# EasyEDA Pro project CandyCaneS2.eprj

# Schematic Schematic1

## Sheets
1 P1: Board Name: Board1; Create Date: 2024-09-03
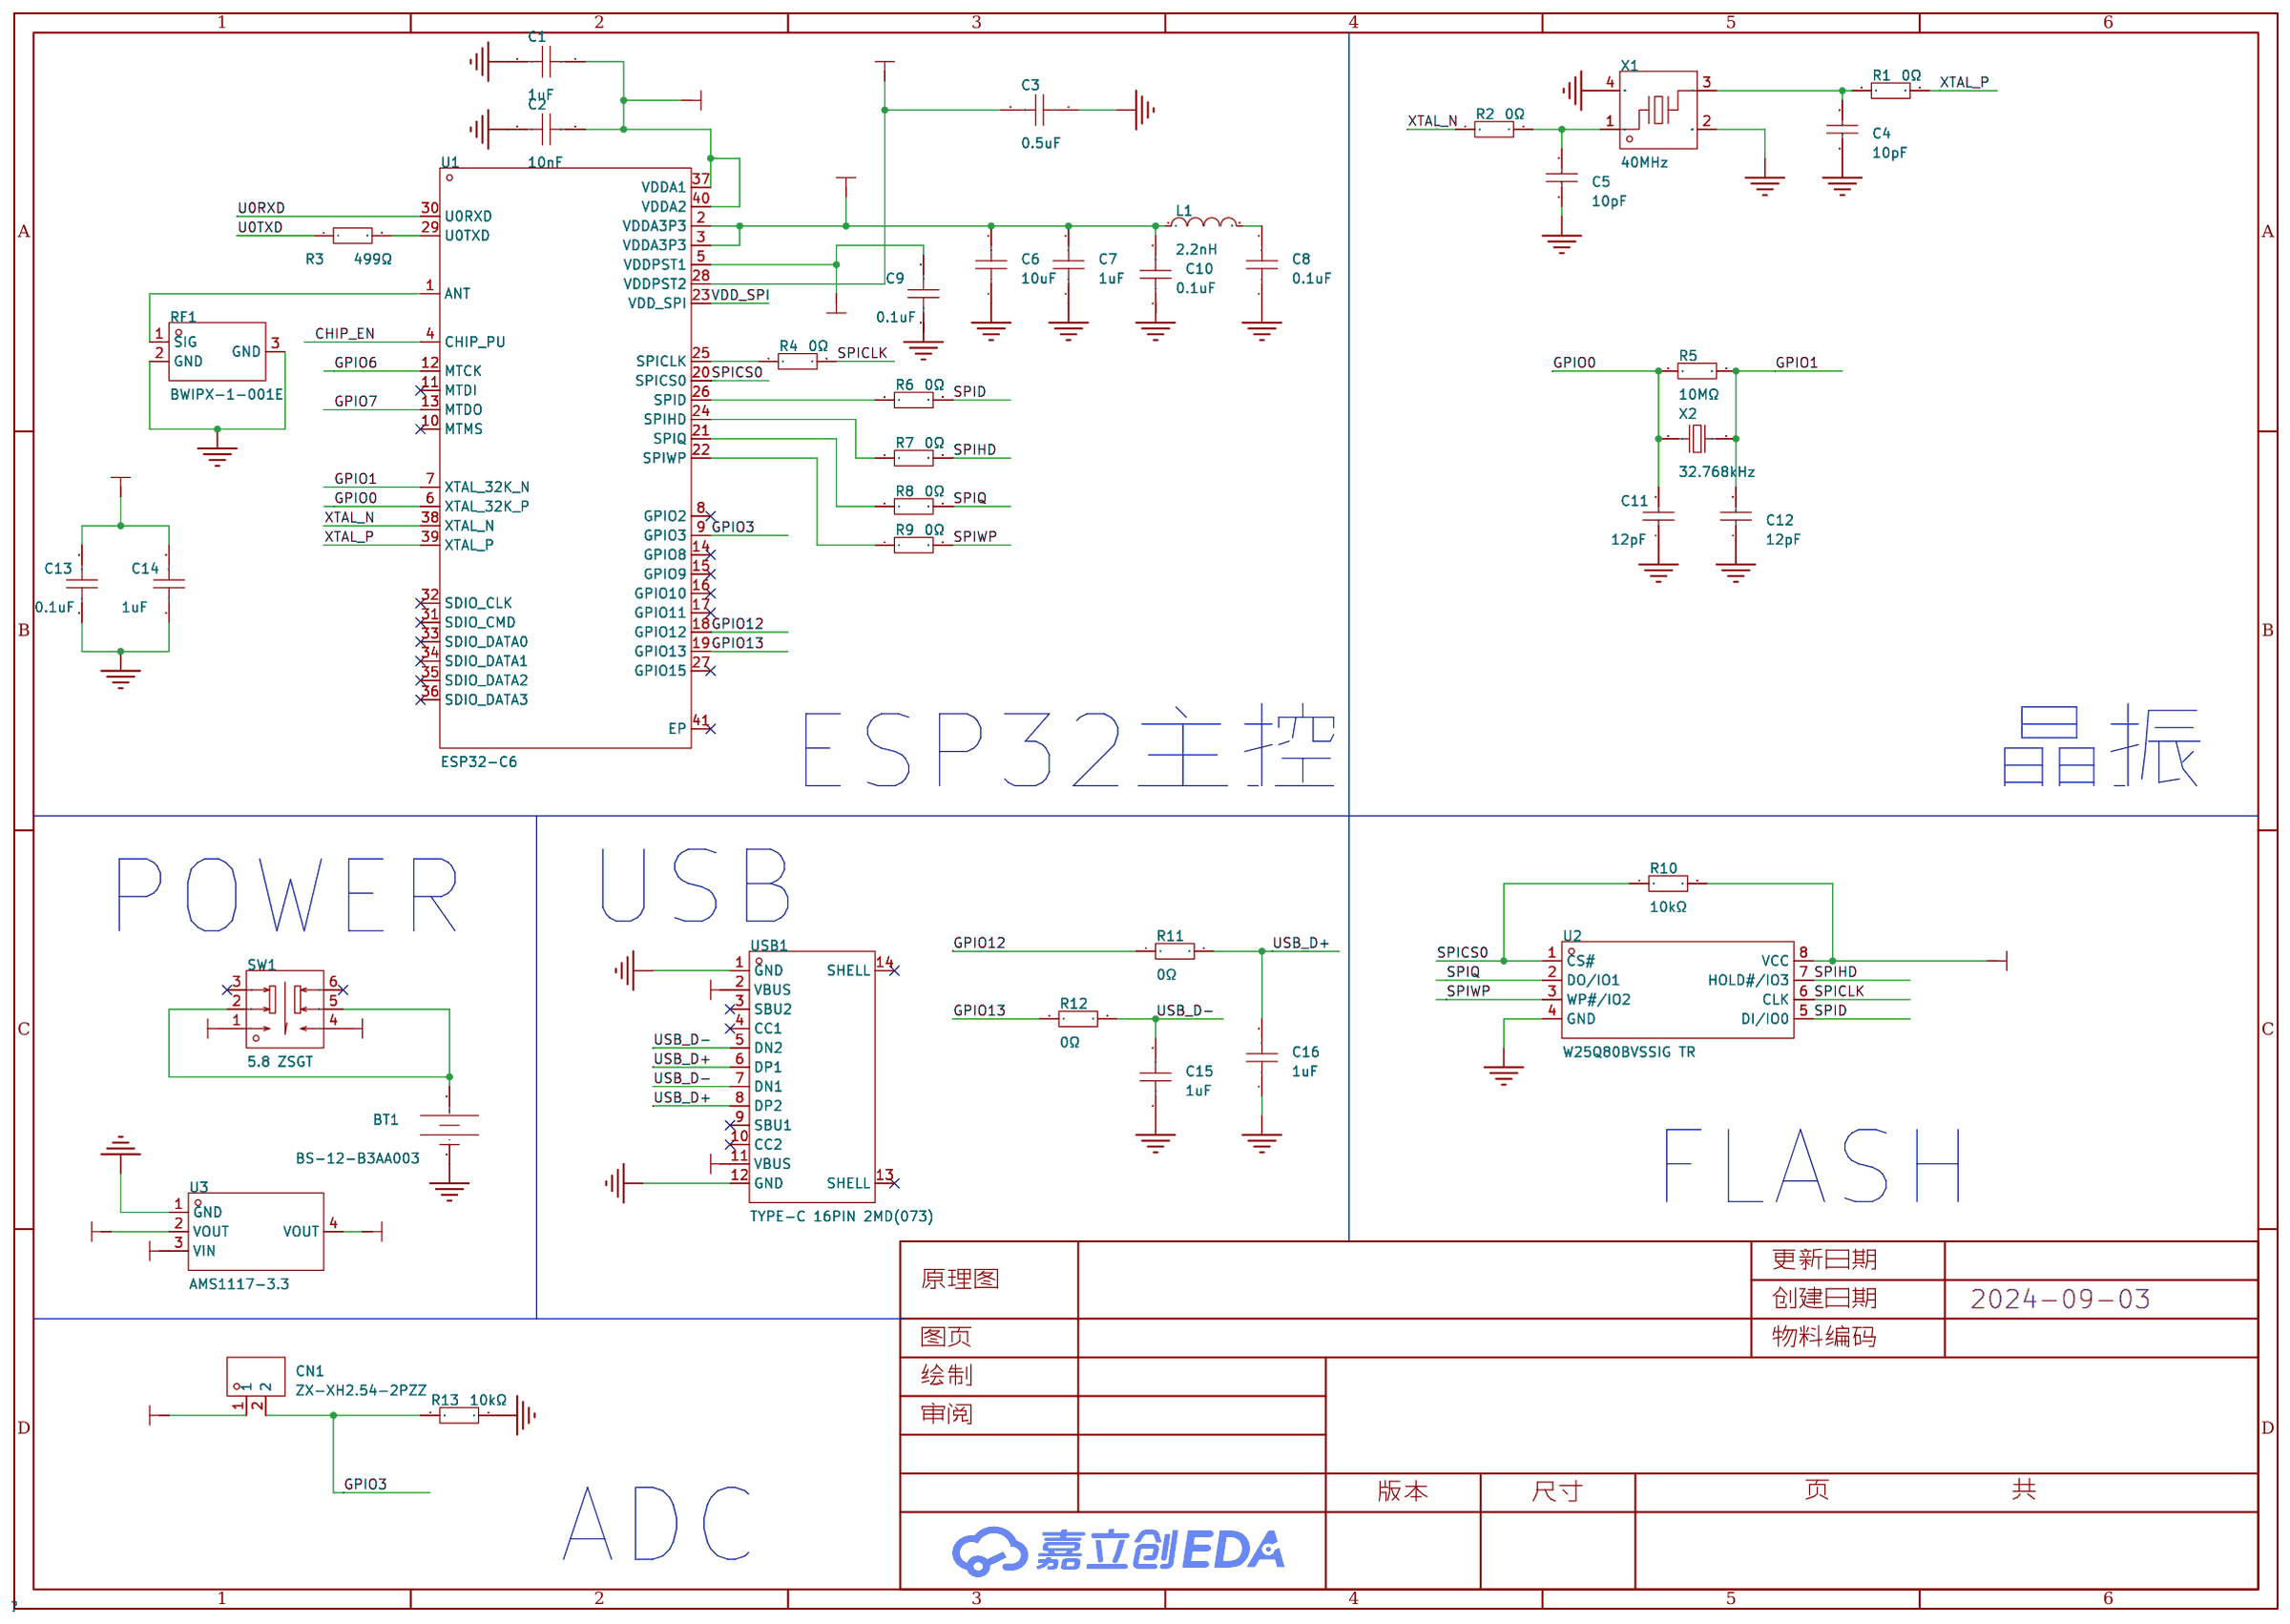
[diagram p0: P1]
2 P2
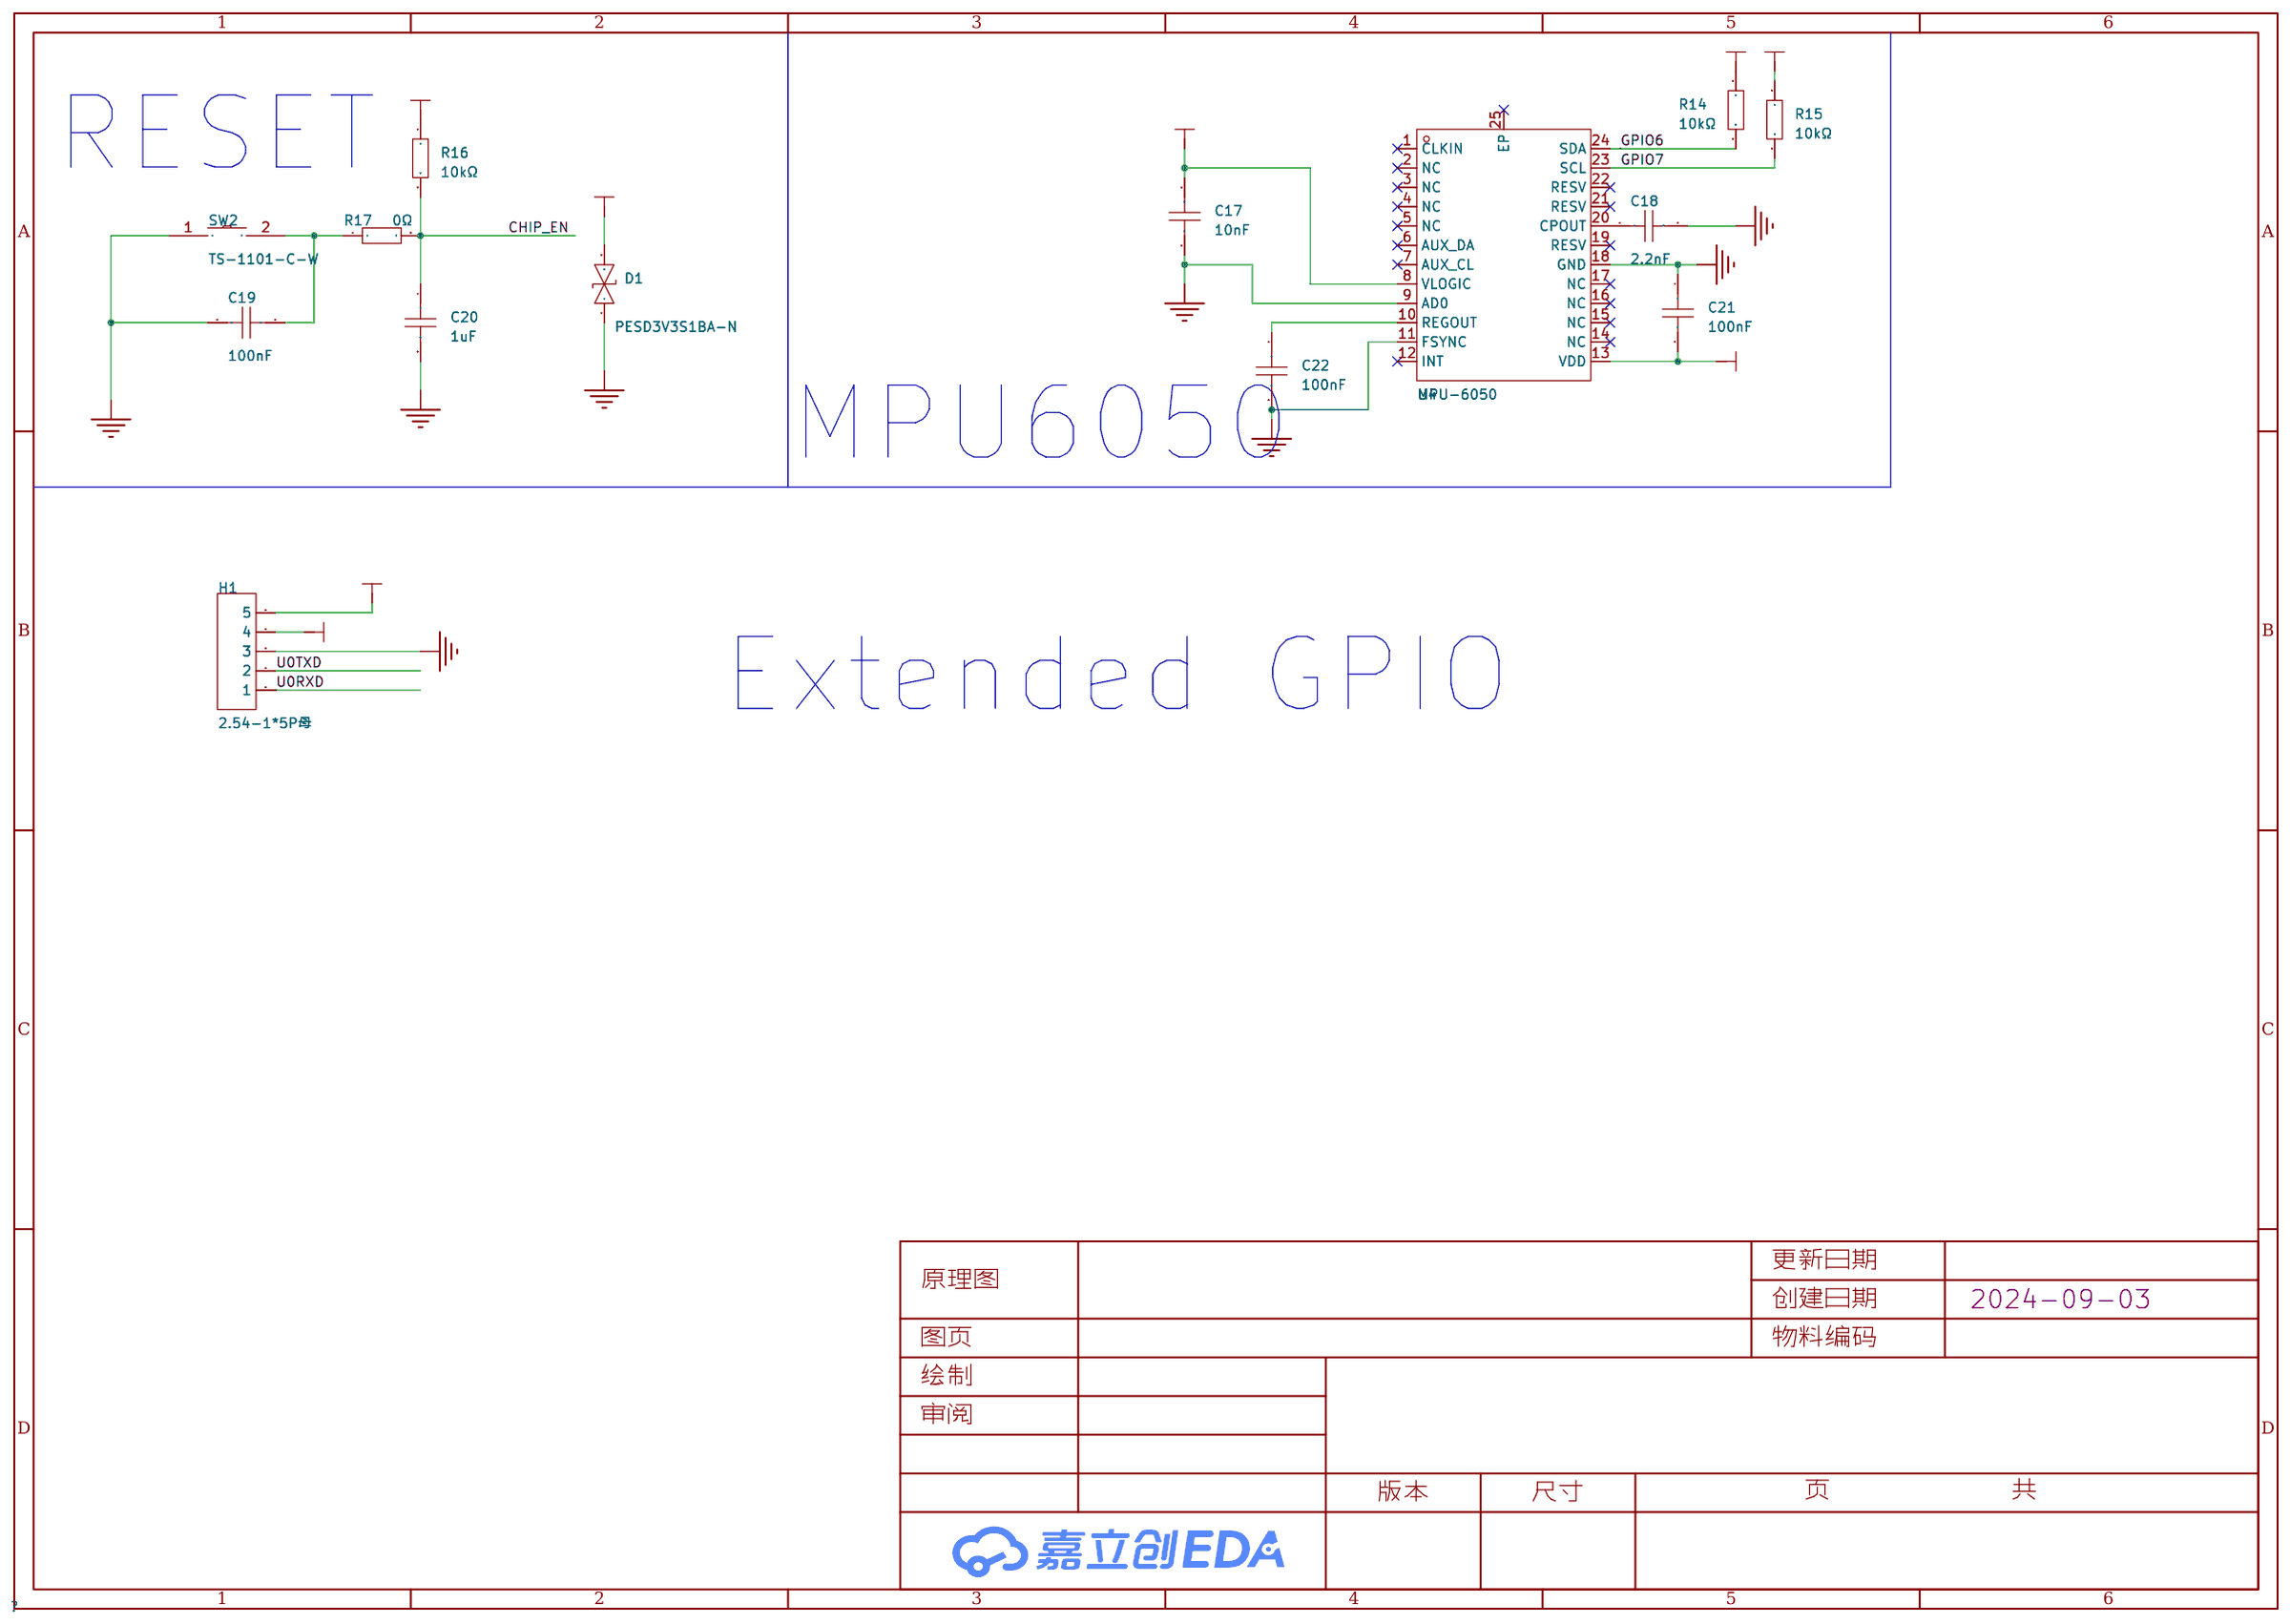
[diagram p1: P2]

## Parts
sheet P1
BT1  BS-12-B3AA003  [BAT-SMD_BS-12-B3AA011]
C1  1uF  [C0603]
C2  10nF  [C0603]
C3  0.5uF  [C0603]
C4  10pF  [C0603]
C5  10pF  [C0603]
C6  10uF  [C0603]
C7  1uF  [C0603]
C8  0.1uF  [C0603]
C9  0.1uF  [C0603]
C10  0.1uF  [C0603]
C11  12pF  [C0603]
C12  12pF  [C0603]
C13  0.1uF  [C0603]
C14  1uF  [C0603]
C15  1uF  [C0603]
C16  1uF  [C0603]
CN1  ZX-XH2.54-2PZZ  [CONN-TH_2P-P2.50_HX25003-2A]
L1  2.2nH  [L0603]
R1  0Ω  [R0603]
R2  0Ω  [R0603]
R3  499Ω  [R0603]
R4  0Ω  [R0603]
R5  10MΩ  [R0603]
R6  0Ω  [R0603]
R7  0Ω  [R0603]
R8  0Ω  [R0603]
R9  0Ω  [R0603]
R10  10kΩ  [R0603]
R11  0Ω  [R0603]
R12  0Ω  [R0603]
R13  10kΩ  [R0603]
RF1  BWIPX-1-001E  [IPEX-SMD_BWIPX-1-001E]
SW1  5.8 ZSGT  [SW-TH_5.8ZSGT]
U1  ESP32-C6  [QFN-40_L5.0-W5.0-P0.40-TL-EP3.3]
U2  W25Q80BVSSIG TR  [SOIC-8_L5.3-W5.3-P1.27-LS7.9-BL]
U3  AMS1117-3.3  [SOT-223-3_L6.5-W3.4-P2.30-LS7.0-BR]
USB1  TYPE-C 16PIN 2MD(073)  [USB-C-SMD_TYPE-C-6PIN-2MD-073]
X1  40MHz  [CRYSTAL-SMD_4P-L3.2-W2.5-BL]
X2  32.768kHz  [FC-135R_L3.2-W1.5]
sheet P2
C17  10nF  [C0603]
C18  2.2nF  [C0603]
C19  100nF  [C0603]
C20  1uF  [C0603]
C21  100nF  [C0603]
C22  100nF  [C0603]
D1  PESD3V3S1BA-N  [SOD-523_L1.2-W0.8-LS1.6-BI]
H1  2.54-1*5P母  [HDR-TH_5P-P2.54-V-F]
R14  10kΩ  [R0603]
R15  10kΩ  [R0603]
R16  10kΩ  [R0603]
R17  0Ω  [R0603]
SW2  TS-1101-C-W  [SW-SMD_L6.0-W3.3-LS8.0]
U4  MPU-6050  [QFN-24_L4.0-W4.0-P0.50-BL-EP2.7]

## Library data of the parts
BT1 = BS-12-B3AA003: 连接器类型:电池底座;适用电池规格:CR1220;触头材质:磷青铜;工作温度范围:-25℃~+85℃;; LCSC Part Name: 电池底座 适用电池:CR1220; Supplier Part: C964723; Manufacturer: MYOUNG(美阳); Supplier Footprint: SMD; JLCPCB Part Class: 扩展库; Datasheet: https://atta.szlcsc.com/upload/public/pdf/source/20201218/C964723_733B638E287393F86295A2A4DAE43C75.pdf; Supplier: LCSC; Connector Type: 电池底座; Battery Type: CR1220; Contact Material: 磷青铜; Operating Temperature Range: -25℃~+85℃
C1-C3 C6-C10 C13 C14 = CL10A106MA8NRNC: 容值:10uF;精度:±20%;额定电压:25V;材质(温度系数):X5R;; LCSC Part Name: 10uF ±20% 25V; Supplier Part: C96446; Manufacturer: SAMSUNG(三星); Supplier Footprint: 0603; JLCPCB Part Class: 基础库; Datasheet: https://atta.szlcsc.com/upload/public/pdf/source/20160218/1457707763339.pdf; Supplier: LCSC; Tolerance: ±20%; Voltage Rated: 25V; Temperature Coefficient: X5R
C4 C5 C11 C12 = CL10C100JB8NNNC: 容值:10pF;精度:±5%;额定电压:50V;材质(温度系数):C0G;; LCSC Part Name: 10pF ±5% 50V; Supplier Part: C1634; Manufacturer: SAMSUNG(三星); Supplier Footprint: 0603; JLCPCB Part Class: 基础库; Datasheet: https://atta.szlcsc.com/upload/public/pdf/source/20160218/1457707763339.pdf; Supplier: LCSC; Tolerance: ±5%; Voltage Rated: 50V; Temperature Coefficient: C0G
C15 C16 = CL10A105KB8NNNC: 容值:1uF;精度:±10%;额定电压:50V;材质(温度系数):X5R;; LCSC Part Name: 1uF ±10% 50V; Supplier Part: C15849; Manufacturer: SAMSUNG(三星); Supplier Footprint: 0603; JLCPCB Part Class: 基础库; Datasheet: https://atta.szlcsc.com/upload/public/pdf/source/20160218/1457707763339.pdf; Supplier: LCSC; Tolerance: ±10%; Voltage Rated: 50V; Temperature Coefficient: X5R
CN1 = ZX-XH2.54-2PZZ: 插针结构:1x2P;间距:2.54mm;安装方式:直插;参考系列:XH;总PIN数:2P;排数:1;每排PIN数:2;行距:-;额定电流:3A;触头材质:黄铜;触头镀层:锡;工作温度范围:-25℃~+85℃;; Supplier Part: C7429632; Manufacturer: Megastar(兆星); Supplier Footprint: 插件,P=2.54mm; JLCPCB Part Class: 扩展库; Datasheet: https://atta.szlcsc.com/upload/public/pdf/source/20230619/19BA6947230AA44A04D3EDD65E618FD0.pdf; Supplier: LCSC; Pins Structure: 1x2P; Pitch: 2.54mm; Mounting Style: 直插; Reference Series: XH; Number of Pins: 2P; Number of Rows: 1; Number of PINs Per Row: 2; Current Rating (Max): 3A; Contact Material: 黄铜; Contact Plating: 锡; Operating Temperature Range: -25℃~+85℃
L1 = SCC1608C2N2SSP: 电感值:2.2nH;额定电流:500mA;饱和电流(Isat):-;直流电阻(DCR):200mΩ;; Supplier Part: C412026; Manufacturer: Sunltech(韩国顺磁); Supplier Footprint: 0603; JLCPCB Part Class: 扩展库; Datasheet: https://atta.szlcsc.com/upload/public/pdf/source/20190819/C412052_7E47CA9107AD18C13168C896A90007C8.pdf; Supplier: LCSC; Rated Current: 500mA; DC Resistance (DCR): 200mΩ
R1 R2 R4 R6-R17 = 0603WAF0000T5E: 电阻类型:厚膜电阻;阻值:0Ω;精度:±1%;功率:100mW;最大工作电压:75V;; LCSC Part Name: 0Ω ±1% 100mW 厚膜电阻; Supplier Part: C21189; Manufacturer: UNI-ROYAL(厚声); Supplier Footprint: 0603; JLCPCB Part Class: 基础库; Datasheet: https://atta.szlcsc.com/upload/public/pdf/source/20200306/C422600_1E6D84923E4A46A82E41ADD87F860B5C.pdf; Supplier: LCSC; Type: 厚膜电阻; Tolerance: ±1%; Power(Watts): 100mW; Overload Voltage (Max): 75V; Operating Temperature Range: -55℃~+155℃
R3 = 0603WAF4990T5E: 电阻类型:厚膜电阻;阻值:499Ω;精度:±1%;功率:100mW;最大工作电压:75V;温度系数:±100ppm/℃;; LCSC Part Name: 499Ω ±1% 100mW 厚膜电阻; Supplier Part: C23065; Manufacturer: UNI-ROYAL(厚声); Supplier Footprint: 0603; JLCPCB Part Class: 扩展库; Datasheet: https://atta.szlcsc.com/upload/public/pdf/source/20200306/C422600_1E6D84923E4A46A82E41ADD87F860B5C.pdf; Supplier: LCSC; Type: 厚膜电阻; Tolerance: ±1%; Power(Watts): 100mW; Overload Voltage (Max): 75V; Temperature Coefficient: ±100ppm/℃; Operating Temperature Range: -55℃~+155℃
R5 = 0603WAF1005T5E: 电阻类型:厚膜电阻;阻值:10MΩ;精度:±1%;功率:100mW;最大工作电压:75V;温度系数:±100ppm/℃;; LCSC Part Name: 10MΩ ±1% 100mW 厚膜电阻; Supplier Part: C7250; Manufacturer: UNI-ROYAL(厚声); Supplier Footprint: 0603; JLCPCB Part Class: 基础库; Datasheet: https://atta.szlcsc.com/upload/public/pdf/source/20200306/C422600_1E6D84923E4A46A82E41ADD87F860B5C.pdf; Supplier: LCSC; Type: 厚膜电阻; Tolerance: ±1%; Power(Watts): 100mW; Overload Voltage (Max): 75V; Temperature Coefficient: ±100ppm/℃; Operating Temperature Range: -55℃~+155℃
RF1 = BWIPX-1-001E: 连接器类型:板端;接口类型:内针;端口数量:1;接口直径:-;接口长度/高度:-;频率-最大值:6GHz;射频系列:IPEX;阻抗:50Ω;样式:-;工作温度范围:-;; LCSC Part Name: IPEX 内针; Supplier Part: C496552; Manufacturer: BAT WIRELESS(蝙蝠无线); Supplier Footprint: SMD; JLCPCB Part Class: 扩展库; Datasheet: https://atta.szlcsc.com/upload/public/pdf/source/20201223/C496552_05E5A9956EAE1A8819C5051D085B1DED.pdf; Supplier: LCSC; Connector Type: 板端; Interface Type: 内针; Number of Ports: 1; Frequency-Max: 6GHz; RF Series: IPEX; Impedance: 50Ω
SW1 = 5.8 ZSGT: 电路结构:双刀双掷;自锁/无锁:自锁;安装方式:直插;触点电流:110mA;额定电压 (DC):30V;带灯:不带;作用力:1.5N;机械寿命:10万次;; LCSC Part Name: 5.8*5.8有头/高头 带锁/自锁开关 泡泡机开关; Supplier Part: C2681587; Manufacturer: SHOU HAN(首韩); Supplier Footprint: 插件; JLCPCB Part Class: 扩展库; Datasheet: https://atta.szlcsc.com/upload/public/pdf/source/20210107/C2681587_CDDDDA4A1C7AC9FEB01815B75893A6BA.pdf; Supplier: LCSC; Circuit: 双刀双掷; Self Lock / No Lock: 自锁; Actuator Style: 方形按钮; Mounting Style: 直插; Contact Current: 110mA; Voltage Rating (DC): 30V; Insulation Resistance: 100MΩ; Actuator/Cap Color: 白色; With Lamp: 不带; Pin Style: PC引脚; Operating Force: 1.5N; Operating Temperature: -10℃~+70℃; Mechanical Life: 10万次
U1 = ESP32-C6_1: Supplier Part: C5364646; Manufacturer: ESPRESSIF(乐鑫); Supplier Footprint: QFN-40-EP(5x5); JLCPCB Part Class: 扩展库; Datasheet: https://atta.szlcsc.com/upload/public/pdf/source/20240709/55E0756C6C858111D660688444CD08EE.pdf; Supplier: LCSC
U2 = W25Q80BVSSIG TR: Supplier Part: C19315515; Manufacturer: WINBOND(华邦); Supplier Footprint: SOIC-8; JLCPCB Part Class: 扩展库; Datasheet: https://atta.szlcsc.com/upload/public/pdf/source/20231219/79C5C7080006D2B8D7319E62F0D0E051.pdf; Supplier: LCSC
U3 = AMS1117-3.3_C6186: 输出类型:固定;最大输入电压:-;输出电压:3.3V;最大输出电流:1A;电源纹波抑制比(PSRR):72dB@(120Hz);输出极性:正极;; LCSC Part Name: 输出3.3V 1A; Supplier Part: C6186; Manufacturer: AMS; Supplier Footprint: SOT-223; JLCPCB Part Class: 基础库; Datasheet: https://atta.szlcsc.com/upload/public/pdf/source/20180727/C6186_7A095716F0823C02F1997A905E26C086.pdf; Supplier: LCSC; Output Type: 固定; Output Voltage: 3.3V; MAX Output Current: 1A; Power Supply Rejection Ratio (PSRR): 72dB@(120Hz); Dropout Voltage: 1.3V@(800mA); Output Polarity: 正极; Number of Outputs: 1
USB1 = TYPE-C 16PIN 2MD(073): 连接器类型:Type-C;标准:-;公母:母;端口数量:1;触点数量:16P;安装方式:卧贴;额定电流 - 电源:5A;工作温度范围:-25℃~+85℃;; LCSC Part Name: Type-C 母 卧贴; Supplier Part: C2765186; Manufacturer: SHOU HAN(首韩); Supplier Footprint: SMD; JLCPCB Part Class: 扩展库; Datasheet: https://atta.szlcsc.com/upload/public/pdf/source/20211123/39B17C16241EAC15C5E277BDA434118E.pdf; Supplier: LCSC; Connector Type: Type-C; Gender: 母; Number of Ports: 1; Number of Contacts: 16P; Mounting Style: 卧贴; Current Rating - Power (Max): 5A; Operating Temperature Range: -25℃~+85℃
X1 = XL2EL89COI-111YLC-40M: 晶振类型:贴片晶振;频率:40MHz;常温频差:±10ppm;外接负载电容:12pF;频率稳定度(全温):±20ppm;; LCSC Part Name: 40MHz ±10ppm 12pF; Supplier Part: C18214314; Manufacturer: YXC(扬兴晶振); Supplier Footprint: SMD3225-4P; JLCPCB Part Class: 扩展库; Datasheet: https://atta.szlcsc.com/upload/public/pdf/source/20240329/19D5F850207469550BEB00D7DFEDBC7A.pdf; Supplier: LCSC; Crystal Type: 贴片晶振; Normal temperature Frequency Tolerance: ±10ppm; External load capacitor: 12pF; Frequency Stability(Full temperature range): ±20ppm; Operating Temperature: -40℃~+85℃
X2 = Q13FC13500004_C32346: 晶振类型:贴片晶振;频率:32.768kHz;常温频差:±20ppm;外接负载电容:12.5pF;; LCSC Part Name: 32.768kHz ±20ppm 12.5pF; Supplier Part: C32346; Manufacturer: EPSON(爱普生); Manufacturer Part: Q13FC13500004; Supplier Footprint: SMD3215-2P; JLCPCB Part Class: 基础库; Datasheet: https://atta.szlcsc.com/upload/public/pdf/source/20240418/0E0FF5F0356BA3753F616001439D1416.pdf; Supplier: LCSC; Crystal Type: 贴片晶振; Normal temperature Frequency Tolerance: ±20ppm; External load capacitor: 12.5pF; Equivalent Series Resistance (ESR): 70kΩ; Operating Temperature: -40℃~+85℃
C17-C22 = CL10B104KB8NNNC: 容值:100nF;精度:±10%;额定电压:50V;材质(温度系数):X7R;; LCSC Part Name: 100nF ±10% 50V; Supplier Part: C1591; Manufacturer: SAMSUNG(三星); Supplier Footprint: 0603; JLCPCB Part Class: 扩展库; Datasheet: https://atta.szlcsc.com/upload/public/pdf/source/20160218/1457707763339.pdf; Supplier: LCSC; Tolerance: ±10%; Voltage Rated: 50V; Temperature Coefficient: X7R
D1 = PESD3V3S1BA-N_C316037: 反向截止电压(Vrwm):3.3V@Max;最大钳位电压:10V;峰值脉冲电流(Ipp)@10/1000us:10A@8/20us;击穿电压:4V;; Supplier Part: C316037; Manufacturer: BORN(伯恩半导体); Supplier Footprint: SOD-523; JLCPCB Part Class: 扩展库; Datasheet: https://atta.szlcsc.com/upload/public/pdf/source/20181025/C316037_BAF19C01D27FCD10CB9CD774B67153C5.pdf; Supplier: LCSC; Reverse Stand-Off Voltage (Vrwm): 3.3V@Max; Maximum Clamping Voltage: 10V; Peak Pulse Current (Ipp)@10/1000us: 10A@8/20us; Breakdown Voltage: 4V; Type: TVS
H1 = 2.54-1*5P母: 插孔结构:1x5P;间距:2.54mm;行距:-;安装类型:直插;排数:单排;总孔位数:5P;塑高:-;触头材质:-;触头镀层:-;; LCSC Part Name: 间距:2.54mm 1x5P 直插; Supplier Part: C50950; Manufacturer: BOOMELE(博穆精密); Supplier Footprint: 插件,P=2.54mm; JLCPCB Part Class: 扩展库; Datasheet: https://atta.szlcsc.com/upload/public/pdf/source/20210301/C2718488_F4427B881E42CAA8DDB0B1C12B3A522C.pdf; Supplier: LCSC; Holes Structure: 1x5P; Pitch: 2.54mm; Mounting Type: 直插; Number of Rows: 单排; Number of Holes: 5P
SW2 = TS-1101-C-W: 电路结构:单刀单掷;按钮形状:矩形按钮;作用力:260gf;安装方式:立贴;开关长度:6mm;开关宽度:3.6mm;开关高度:2.5mm;带支架:不带;触点电流:50mA;额定电压(AC):-;额定电压(DC):12V;额定功率:-;绝缘电阻:-;带灯:无;机械寿命:5万次;; LCSC Part Name: 6*3.6*2.5mm 立贴 轻触开关; Supplier Part: C318938; Manufacturer: XKB Connectivity(中国星坤); Supplier Footprint: SMD; JLCPCB Part Class: 扩展库; Datasheet: https://atta.szlcsc.com/upload/public/pdf/source/20200227/C318938_C2E53B1EEDE37D980A33616AC086DE53.pdf; Supplier: LCSC; Circuit: 单刀单掷; Actuator Style: 矩形按钮; Operating Force: 260gf; Mounting Style: 立贴; Switch Length: 6mm; Switch Width: 3.6mm; Switch Height: 2.5mm; Strike Gundam: 不带; Contact Current: 50mA; Voltage Rating (DC): 12V; Actuator/Cap Color: 白色带淡绿; With Lamp: 无; Mechanical Life: 5万次; Operating Temperature: -30℃~+85℃
U4 = MPU-6050: 传感器类型:加速度计陀螺仪;; Supplier Part: C24112; Manufacturer: TDK InvenSense(应美盛); Supplier Footprint: QFN-24-EP(4x4); JLCPCB Part Class: 扩展库; Datasheet: https://atta.szlcsc.com/upload/public/pdf/source/20140425/1457707046159.pdf; Supplier: LCSC; Sensor Type: 加速度计陀螺仪; Operating Temperature: -40℃~+85℃

## Nets
GND: BT1.2(-) C1.2 C2.1 C3.1 C4.1 C5.1 C6.1 C7.1 C8.1 C9.1 C10.1 C11.1 C12.1 C13.1 C14.1 C15.1 C16.1 C17.2 C18.2 C19.2 C20.2 C21.1 C22.2 D1.1 H1.3 R13.2 RF1.2(GND) RF1.3(GND) SW2.1 U2.4(GND) U3.1(GND) U4.9(AD0) U4.11(FSYNC) U4.18(GND) USB1.1(GND) USB1.12(GND) X1.2(GND) X1.4(GND)
VBAT: H1.5 SW1.1 SW1.4 U3.3(VIN) USB1.2(VBUS) USB1.11(VBUS)
VDD33: C1.1 C2.2 C3.2 C6.2 C7.2 C9.2 C10.2 C17.1 C21.2 CN1.1 D1.2 H1.4 L1.1 R14.1 R15.1 R16.1 U1.2(VDDA3P3) U1.3(VDDA3P3) U1.5(VDDPST1) U1.28(VDDPST2) U1.37(VDDA1) U1.40(VDDA2) U3.2(VOUT) U3.4(VOUT) U4.8(VLOGIC) U4.13(VDD)
VDD_SPI: C13.2 C14.2 R10.2 U1.23(VDD_SPI) U2.8(VCC)
CHIP_EN: C20.1 R16.2 R17.2 U1.4(CHIP_PU)
GPIO0: C11.2 R5.1 U1.6(XTAL_32K_P) X2.1
GPIO1: C12.2 R5.2 U1.7(XTAL_32K_N) X2.2
GPIO3: CN1.2 R13.1 U1.9(GPIO3)
GPIO6: R14.2 U1.12(MTCK) U4.24(SDA)
GPIO7: R15.2 U1.13(MTDO) U4.23(SCL)
GPIO12: R11.1 U1.18(GPIO12)
GPIO13: R12.1 U1.19(GPIO13)
SPICLK: R4.2 U2.6(CLK)
SPICS0: R10.1 U1.20(SPICS0) U2.1(CS#)
SPID: R6.2 U2.5(DI/IO0)
SPIHD: R7.2 U2.7(HOLD#/IO3)
SPIQ: R8.2 U2.2(DO/IO1)
SPIWP: R9.2 U2.3(WP#/IO2)
U0RXD: H1.1 U1.30(U0RXD)
U0TXD: H1.2 R3.1
USB_D+: C16.2 R11.2 USB1.6(DP1) USB1.8(DP2)
USB_D-: C15.2 R12.2 USB1.5(DN2) USB1.7(DN1)
XTAL_N: R2.1 U1.38(XTAL_N)
XTAL_P: R1.2 U1.39(XTAL_P)
$1N461: RF1.1(SIG) U1.1(ANT)
$1N695: C8.2 L1.2
$1N1096: R4.1 U1.25(SPICLK)
$1N1204: R8.1 U1.21(SPIQ)
$1N1242: R9.1 U1.22(SPIWP)
$1N1499: R7.1 U1.24(SPIHD)
$1N1548: R6.1 U1.26(SPID)
$1N1698: R3.2 U1.29(U0TXD)
$1N2295: C4.2 R1.1 X1.3
$1N2413: C5.2 R2.2 X1.1
$1N3029: BT1.1(+) SW1.2 SW1.5
$2N245: C19.1 R17.1 SW2.2
$2N875: C18.1 U4.20(CPOUT)
$2N1093: C22.1 U4.10(REGOUT)

Not connected (* = marked no-connect by the designer): SW1 3* 6*; U1 8(GPIO2)* 10(MTMS)* 11(MTDI)* 14(GPIO8)* 15(GPIO9)* 16(GPIO10)* 17(GPIO11)* 27(GPIO15)* 31(SDIO_CMD)* 32(SDIO_CLK)* 33(SDIO_DATA0)* 34(SDIO_DATA1)* 35(SDIO_DATA2)* 36(SDIO_DATA3)* 41(EP)*; U4 1(CLKIN)* 2(NC)* 3(NC)* 4(NC)* 5(NC)* 6(AUX_DA)* 7(AUX_CL)* 12(INT)* 14(NC)* 15(NC)* 16(NC)* 17(NC)* 19(RESV)* 21(RESV)* 22(RESV)* 25(EP)*; USB1 3(SBU2)* 4(CC1)* 9(SBU1)* 10(CC2)* 13(SHELL)* 14(SHELL)*

## Notes on the sheets
sheet 1
- ESP32主控
- 晶振
- USB
- POWER
- FLASH
- ADC
sheet 2
- RESET
- MPU6050
- Extended GPIO

# Board PCB1
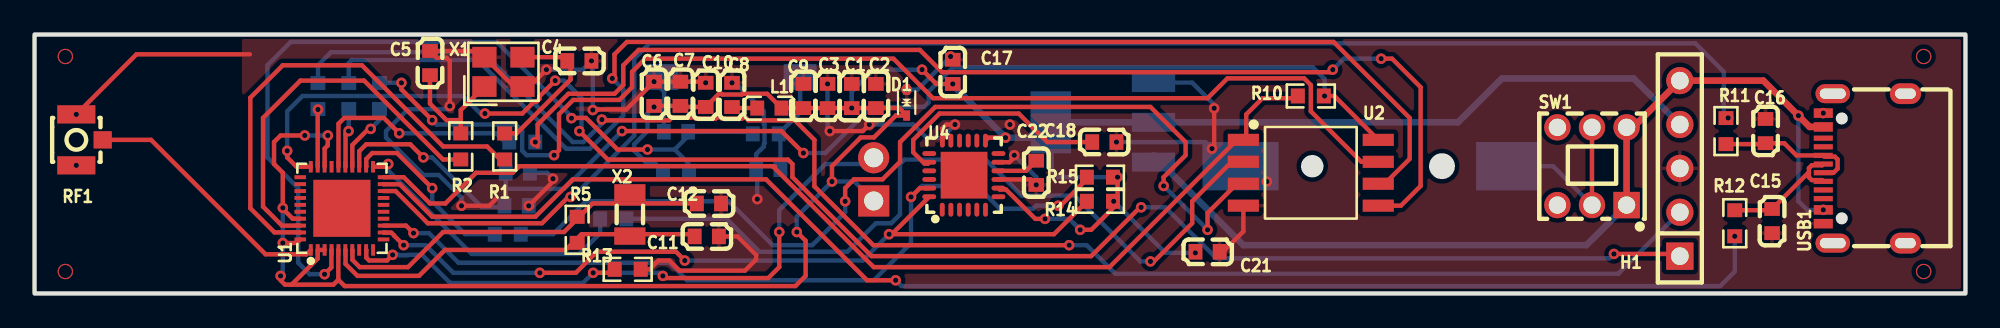
[diagram p2: board, top side]
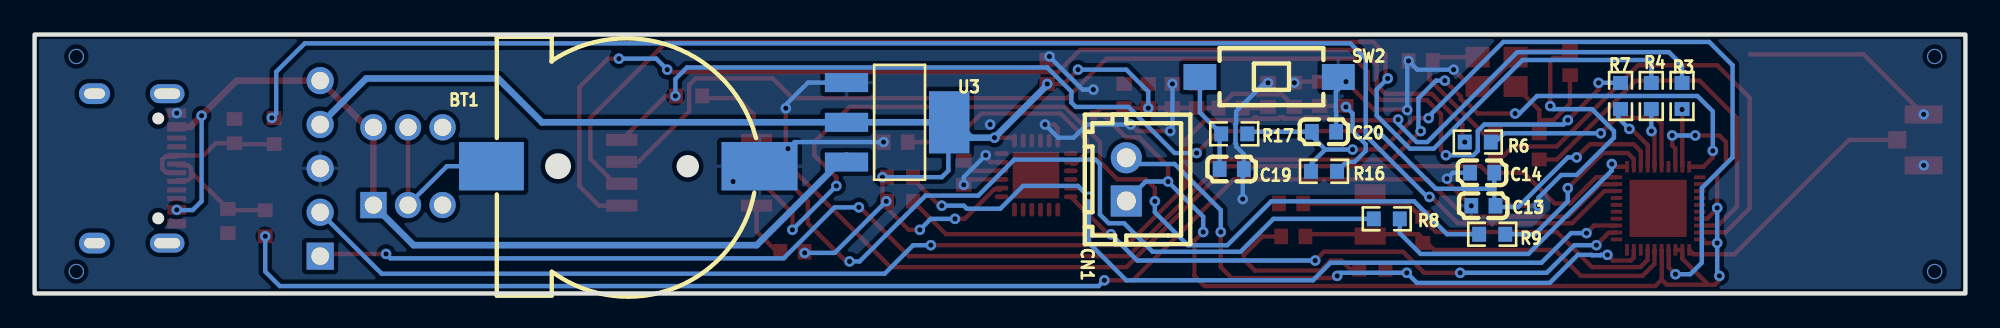
[diagram p3: board, bottom side, seen from below]

Outline 111.63 x 14.99 mm; copper layers: Top Layer, Bottom Layer. Coordinates in mm from the lower left corner of the outline.
Outline path: rectangle 0,14.99 111.63,0
Stack: Top Layer 0.035mm / Dielectric1 1.51mm FR4 er 4.5 / Bottom Layer 0.035mm

## Design rules (mm)
template: JLCPCB Capability(Two Layers Board)
spacing copperThickness1oz (default): track to track 0.102, other pairs 0.152 to 0.3
spacing copperThickness2oz: track to track 0.203, other pairs 0.152 to 0.3
track width copperThickness1oz (default): min 0.127, default 0.254, max 2.54
track width copperThickness2oz: min 0.203, default 0.254, max 2.54
differential pair differentialPair (default): width min 0.127, default 0.254, max 2.54; gap min 0.152, default 0.152
via viaSize (default): diameter min 0.5, default 0.61, max 10; hole min 0.3, default 0.305, max 6.3

## Placement (name value [footprint] x y rotation side)
BT1  BS-12-B3AA003  [BAT-SMD_BS-12-B3AA011]  77.47 7.37 0 bottom
C1  1uF  [C0603]  47.24 11.43 90 top
C2  10nF  [C0603]  48.64 11.43 270 top
C3  0.5uF  [C0603]  45.85 11.43 270 top
C4  10pF  [C0603]  31.5 13.46 180 top
C5  10pF  [C0603]  22.86 13.34 270 top
C6  10uF  [C0603]  35.81 11.56 270 top
C7  1uF  [C0603]  37.34 11.56 270 top
C8  0.1uF  [C0603]  40.32 11.49 270 top
C9  0.1uF  [C0603]  44.45 11.43 270 top
C10  0.1uF  [C0603]  38.8 11.5 270 top
C11  12pF  [C0603]  38.86 3.3 180 top
C12  12pF  [C0603]  38.99 5.21 180 top
C13  0.1uF  [C0603]  27.87 5.07 180 bottom
C14  1uF  [C0603]  27.94 6.98 180 bottom
C15  1uF  [C0603]  100.46 4.19 90 top
C16  1uF  [C0603]  100.08 9.4 270 top
C17  10nF  [C0603]  53.09 12.83 90 top
C18  2.2nF  [C0603]  61.85 8.76 0 top
C19  100nF  [C0603]  42.42 7.2 180 bottom
C20  1uF  [C0603]  37.08 9.36 180 bottom
C21  100nF  [C0603]  67.82 2.41 180 top
C22  100nF  [C0603]  57.91 6.98 270 top
CN1  ZX-XH2.54-2PZZ  [CONN-TH_2P-P2.50_HX25003-2A]  48.51 6.6 90 bottom
D1  PESD3V3S1BA-N  [SOD-523_L1.2-W0.8-LS1.6-BI]  50.42 11.05 270 top
H1  2.54-1*5P母  [HDR-TH_5P-P2.54-V-F]  95.12 7.24 90 top
L1  2.2nH  [L0603]  42.48 10.73 180 top
R1  0Ω  [R0603]  27.18 8.51 270 top
R2  0Ω  [R0603]  24.64 8.51 90 top
R3  499Ω  [R0603]  16.38 11.43 270 bottom
R4  0Ω  [R0603]  18.16 11.43 90 bottom
R5  10MΩ  [R0603]  31.37 3.68 90 top
R6  0Ω  [R0603]  28.19 8.76 0 bottom
R7  0Ω  [R0603]  19.94 11.43 90 bottom
R8  0Ω  [R0603]  33.45 4.32 0 bottom
R9  0Ω  [R0603]  27.36 3.43 0 bottom
R10  10kΩ  [R0603]  73.79 11.43 0 top
R11  0Ω  [R0603]  97.79 9.4 270 top
R12  0Ω  [R0603]  98.3 4.06 90 top
R13  10kΩ  [R0603]  34.29 1.4 0 top
R14  10kΩ  [R0603]  61.59 5.33 180 top
R15  10kΩ  [R0603]  61.59 6.73 180 top
R16  10kΩ  [R0603]  37.08 7.07 0 bottom
R17  0Ω  [R0603]  42.27 9.24 180 bottom
RF1  BWIPX-1-001E  [IPEX-SMD_BWIPX-1-001E]  3.17 8.89 180 top
SW1  5.8 ZSGT  [SW-TH_5.8ZSGT]  90.04 7.37 0 top
SW2  TS-1101-C-W  [SW-SMD_L6.0-W3.3-LS8.0]  40.26 12.53 0 bottom
U1  ESP32-C6  [QFN-40_L5.0-W5.0-P0.40-TL-EP3.3]  17.77 4.93 90 top
U2  W25Q80BVSSIG TR  [SOIC-8_L5.3-W5.3-P1.27-LS7.9-BL]  73.79 6.98 270 top
U3  AMS1117-3.3  [SOT-223-3_L6.5-W3.4-P2.30-LS7.0-BR]  61.72 9.91 0 bottom
U4  MPU-6050  [QFN-24_L4.0-W4.0-P0.50-BL-EP2.7]  53.73 6.85 0 top
USB1  TYPE-C 16PIN 2MD(073)  [USB-C-SMD_TYPE-C-6PIN-2MD-073]  105.79 7.24 90 top
X1  40MHz  [CRYSTAL-SMD_4P-L3.2-W2.5-BL]  27.11 12.83 0 top
X2  32.768kHz  [FC-135R_L3.2-W1.5]  34.42 4.57 90 top

## Footprints (pads in the part's own frame, mm; a bottom-side part is the same pattern mirrored in y, then rotated)
BAT-SMD_BS-12-B3AA011
  rect 3.75x2.8 smd: 1(7.75,0)
  rect 4.4x2.8 smd: 2(-7.75,0)
C0603
  rect 0.8x0.9 smd: 1(-0.7,0) 2(0.7,0)
CONN-TH_2P-P2.50_HX25003-2A
  rect 1.8x1.8 hole 1.1: 1(-1.25,0)
  round 1.8 hole 1.1: 2(1.25,0)
CRYSTAL-SMD_4P-L3.2-W2.5-BL
  rect 1.4x1.2 smd: 1(-1.1,-0.85) 2(1.1,-0.85) 3(1.1,0.85) 4(-1.1,0.85)
FC-135R_L3.2-W1.5
  rect 1x1.8 smd: 1(-1.25,0) 2(1.25,0)
HDR-TH_5P-P2.54-V-F
  rect 1.575x1.575 hole 1.02: 1(-5.08,0)
  round 1.575 hole 1.02: 2(-2.54,0) 3(0,0) 4(2.54,0) 5(5.08,0)
IPEX-SMD_BWIPX-1-001E
  rect 1.05x1 smd: 1(-0.762,0)
  rect 2.2x1.05 smd: 2(0.762,-1.475) 3(0.762,1.475)
L0603
  rect 0.8x0.864 smd: 1(-0.7,0) 2(0.7,0)
QFN-24_L4.0-W4.0-P0.50-BL-EP2.7
  oval 0.28x0.8 smd: 1(-1.25,-2) 2(-0.75,-2) 3(-0.25,-2) 4(0.25,-2) 5(0.75,-2) 6(1.25,-2) 13(1.25,2) 14(0.75,2) 15(0.25,2) 16(-0.25,2) 17(-0.75,2) 18(-1.242,2)
  oval 0.8x0.28 smd: 7(2,-1.25) 8(2,-0.75) 9(2,-0.25) 10(2,0.25) 11(2,0.75) 12(2,1.25) 19(-2,1.25) 20(-2,0.75) 21(-2,0.25) 22(-2,-0.25) 23(-2,-0.75) 24(-2,-1.25)
  rect 2.7x2.7 smd: 25(0.013,0)
QFN-40_L5.0-W5.0-P0.40-TL-EP3.3
  rect 0.665x0.224 smd: 1(-2.408,1.8) 2(-2.408,1.4) 3(-2.408,1) 4(-2.408,0.6) 5(-2.408,0.2) 6(-2.408,-0.2) 7(-2.408,-0.6) 8(-2.408,-1) 9(-2.408,-1.4) 10(-2.408,-1.8) 21(2.408,-1.8) 22(2.408,-1.4) 23(2.408,-1) 24(2.408,-0.6) 25(2.408,-0.2) 26(2.408,0.2) 27(2.408,0.6) 28(2.408,1) 29(2.408,1.4) 30(2.408,1.8)
  rect 0.224x0.665 smd: 11(-1.8,-2.408) 12(-1.4,-2.408) 13(-1,-2.408) 14(-0.6,-2.408) 15(-0.2,-2.408) 16(0.2,-2.408) 17(0.6,-2.408) 18(1,-2.408) 19(1.4,-2.408) 20(1.8,-2.408) 31(1.8,2.408) 32(1.4,2.408) 33(1,2.408) 34(0.6,2.408) 35(0.2,2.408) 36(-0.2,2.408) 37(-0.6,2.408) 38(-1,2.408) 39(-1.4,2.408) 40(-1.8,2.408)
  rect 3.3x3.3 smd: 41(0,0)
R0603
  rect 0.806x0.864 smd: 1(-0.753,0) 2(0.753,0)
SOD-523_L1.2-W0.8-LS1.6-BI
  rect 0.6x0.4 smd: 1(-0.75,0) 2(0.75,0)
SOIC-8_L5.3-W5.3-P1.27-LS7.9-BL
  rect 0.7x1.8 smd: 1(-1.905,-3.9) 2(-0.635,-3.9) 3(0.635,-3.9) 4(1.905,-3.9) 5(1.905,3.9) 6(0.635,3.9) 7(-0.635,3.9) 8(-1.905,3.9)
SOT-223-3_L6.5-W3.4-P2.30-LS7.0-BR
  rect 2.5x1.1 smd: 1(2.97,-2.3) 2(2.97,0) 3(2.97,2.3)
  rect 2.34x3.6 smd: 4(-2.97,0)
SW-SMD_L6.0-W3.3-LS8.0
  rect 1.9x1.5 smd: 1(-4,0) 2(4,0)
SW-TH_5.8ZSGT
  rect 1.524x1.524 hole 1: 1(2,-2.25)
  round 1.524 hole 1: 2(0,-2.25) 3(-2,-2.25) 4(2,2.25) 5(0,2.25) 6(-2,2.25)
USB-C-SMD_TYPE-C-6PIN-2MD-073
  rect 0.55x1.1 smd: 1(-3.2,2.375) 2(-2.4,2.375) 11(2.4,2.375) 12(3.2,2.375)
  rect 0.3x1.1 smd: 3(-1.75,2.375) 4(-1.25,2.375) 5(-0.75,2.375) 6(-0.25,2.375) 7(0.25,2.375) 8(0.75,2.375) 9(1.25,2.375) 10(1.75,2.375)
  oval 1.1x2 hole 0.6x1.5: 13(-4.325,1.825) 14(4.325,1.825)
  oval 1.2x1.8 hole 0.6x1.2: 13(-4.325,-2.375) 14(4.325,-2.375)

## Nets
As in the schematic.

Pads without a net: SW1 3 6; U1 8 10 11 14 15 16 17 27 31 32 33 34 35 36 41; U4 1 2 3 4 5 6 7 12 14 15 16 17 19 21 22 25; USB1 3 4 9 10 13 14

## Via types
v1: diameter 0.889, hole 0.762, Top Layer to Bottom Layer, 4 vias
v2: diameter 0.61, hole 0.305, Top Layer to Bottom Layer, 93 vias

## Routing (per net, layer and track width the routed paths; a pad name or vN(x,y) marks a point on that pad's centre or on a via; arc(x,y) is an arc through that point)
GND: length 110.9
  Top Layer w0.254: v2(57.91,6.29) 57.6,6.6 U4.9 ; 56.51,7.87 56.51,7.75 56.37,7.6 U4.11 ; v2(28.57,5.07) 29.97,6.48 v2(29.97,6.64) ; U2.4 69.89,3.59 68.59,2.29 68.59,2.16 ; C11.1 40.64,3.3 41.72,2.22 41.72,1.97 41.07,1.32 37.29,1.32 36.7,1.91 36.07,1.91 35.56,1.4 R13.2 ; v2(24,10.85) 24,13.46 23.82,13.64 23.25,13.64 C5.1 25.65,14.04 26.01,13.68 27.71,11.98 X1.2 28.61,11.98 v2(29.59,12.95) ; U4.18 52.49,9.56 52.71,9.78 v2(53.21,9.78) ; 12.45,13.84 5.89,13.84 v2(2.41,10.37) ; v2(32.27,10.62) 32.52,10.62 32.56,10.65 34.21,10.65 v2(35.81,12.26) C7.1 38.74,12.26 v2(38.8,12.2) ; v2(48.26,9.78) 47.88,9.4 v2(45.97,9.4) ; 26.67,5.46 26.29,5.08 v2(24.68,5.08) ; v2(68.2,10.72) 68.2,8.51 v2(68.07,8.38)
  Bottom Layer w0.254: C20.2 36.38,10.54 36.4,10.55 36.4,11.67 v2(35.81,12.26) ; v2(32.2,13.46) 31.69,12.95 v2(29.59,12.95) ; v2(53.21,9.78) 52.45,9.02 51.56,9.02 50.8,9.78 v2(48.26,9.78) ; v2(56.64,8) 57.91,6.73 57.91,6.48 ; 40.26,12.06 40.64,12.06 42.16,10.54 42.16,9.83 42.2,9.79 42.2,8.69 42.16,8.65 42.16,8.51 41.72,8.06 C19.2 41.78,7.13 v2(41.78,5.46) ; v2(50.42,11.8) 51.04,11.8 v2(52.96,13.72) ; v2(62.55,8.76) 67.69,8.76 v2(68.07,8.38) ; 68.2,10.92 66.91,12.21 U3.1 ; C14.1 29.63,6.98 v2(29.97,6.64) ; v2(45.85,12.13) 45.85,9.53 v2(45.97,9.4) ; v2(32.27,10.62) 32.27,13.46 ; v2(24.68,5.08) 24.68,5.55 23.37,6.86 22.48,6.86 20.32,9.02 20.32,9.4 21.59,10.67 23.83,10.67 v2(24,10.85)
  vias: v2(2.41,7.42) v2(40.32,12.19) v2(56.39,9.78) v2(71.25,6.48) v2(103.42,10.44)
VBAT: length 55.1
  Top Layer w0.381: SW1.1 SW1.4 92.42,9.62 H1.5 99.95,12.32 v2(101.98,10.29) 102.63,9.64 USB1.11
  Bottom Layer w0.254: v2(101.98,10.29) 101.98,5.34 102.49,4.83 103.38,4.83
  Bottom Layer w0.381: SW1.1 89.72,2.79 69.88,2.79 64.69,7.99
  vias: v2(103.42,4.84)
VDD33: length 166.3
  Top Layer w0.254: 14.86,0.51 17.27,0.51 17.56,0.8 ; 14.86,0.51 16.37,2.02 U1.2 U1.3 ; 14.86,0.51 14.48,0.51 14.22,0.76 v2(14.22,1.02) ; v2(46.1,6.48) 46.1,7.37 47.77,9.03 48.53,9.03 49.8,10.3 D1.2 49.99,10.73 C2.2 v2(47.24,10.73) C3.2 C9.2 L1.1 42.36,11.56 40.93,11.56 40.89,11.51 39.76,11.51 39.71,11.56 39.56,11.56 C10.2 37.4,10.8 C7.2 C6.2 ; v2(51.31,12.95) 52.13,12.13 v2(53.09,12.13) ; v2(44.07,3.56) 44.58,3.05 44.58,1.02 43.99,0.43 17.93,0.43 17.56,0.8 ; v2(15.62,9.14) 14.22,9.14 13.84,8.76 13.84,7.49 14.35,6.98 v2(14.35,4.95) 14.35,4.9 14.92,4.33 U1.37 ; U1.5 17.56,2.51 17.56,0.8 ; v2(62.61,6.73) 62.61,5.47 62.48,5.33 v2(62.39,5.33) 62.39,4.99 61.09,3.68 v2(60.45,3.68) ; v2(58.42,4.32) 57.86,4.32 56.16,6.02 55.81,6.02 U4.8 ; U4.13 55.15,9.02 v2(56.13,9.02) ; U1.40 15.15,2.92 v2(14.35,2.92) ; v2(16.95,9.14) 16.95,8.57 16.77,8.39 U1.28
  Bottom Layer w0.254: R16.1 35.78,7.62 35.31,7.62 34.67,8.26 34.67,8.64 35.43,9.4 35.43,10.41 v2(35.81,10.8) ; v2(62.39,5.33) 65.38,2.35 v2(67.11,2.35) ; v2(14.22,1.02) 14.35,1.14 v2(14.35,2.92) v2(14.35,4.95) ; v2(51.31,12.95) 48.51,12.95 47.24,11.68 v2(47.24,10.73) ; v2(62.61,6.73) 59.18,6.73 58.8,7.11 58.8,10.24 ; v2(44.07,3.56) 44.07,4.45 v2(46.1,6.48) 47.39,6.48 CN1.1 ; v2(15.62,9.14) v2(16.95,9.14) ; v2(58.42,4.32) 59.82,4.32 v2(60.45,3.68)
  Bottom Layer w0.381: H1.4 92.46,12.45 84.84,12.45 82.3,9.91 U3.2 59.13,9.91 58.75,10.29 57.48,9.02 v2(56.13,9.02) 53.09,12.06 v2(53.09,12.13)
VDD_SPI: length 70
  Top Layer w0.254: v2(74.58,11.43) 75.15,11.43 U2.8 ; v2(33.96,9.4) 43.18,9.4 v2(44.45,8.13) ; v2(22.48,7.87) 21.72,8.64 19.18,8.64 18.77,8.23 U1.23
  Bottom Layer w0.254: v2(33.96,9.4) 30.62,6.06 27.24,6.06 ; 27.24,6.06 27.24,5.15 C13.2 27.1,5 25.86,5 22.99,7.87 v2(22.48,7.87) ; 27.24,6.06 C14.2 ; v2(74.58,11.43) 74.58,12.41 73.91,13.08 53.09,13.08 51.69,11.68 51.69,11.05 51.44,10.8 48.39,10.8 45.72,8.13 v2(44.45,8.13)
(no net):
  vias: v1(1.78,13.72) v1(1.78,1.27) v1(109.22,13.72) v1(109.22,1.27)
CHIP_EN: length 49
  Top Layer w0.254: U1.4 17.16,2.51 17.16,1.51 v2(16.76,1.11) ; v2(31.04,10.15) 31.05,10.16 31.88,10.16 33.71,8.33 v2(35.43,8.33)
  Bottom Layer w0.254: R16.2 37.78,7.12 37.78,7.56 37.01,8.33 ; 37.01,8.33 v2(35.43,8.33) ; 37.01,8.33 37.78,9.11 C20.1 41.4,9.36 R17.2 ; v2(16.76,1.11) 15.91,1.11 15.24,1.78 15.24,6.1 13.46,7.87 13.46,13.21 14.81,14.56 26.72,14.56 30.86,10.41 30.86,10.33 v2(31.04,10.15)
GPIO0: length 22.5
  Top Layer w0.254: U1.6 17.98,2.51 17.98,1.71 18.67,1.02 22.22,1.02 23.73,2.52 30.71,2.52 31.62,3.43 37.85,3.43 38.1,3.17 38.29,3.17
GPIO1: length 22.6
  Top Layer w0.254: U1.7 18.38,2.51 18.38,1.94 18.8,1.52 21.59,1.52 23.62,3.56 30.61,3.56 32.26,5.21 38.29,5.21 38.54,5.46
GPIO3: length 37.2
  Top Layer w0.254: U1.9 19.18,2.51 19.18,2.07 19.34,1.91 20.37,1.91 v2(20.7,2.23) ; R13.1 33.33,1.19 v2(32.29,1.19) ; v2(43.05,3.56) 43.05,1.52 42.42,0.89 36.45,0.89 v2(36.32,1.02)
  Bottom Layer w0.254: v2(20.7,2.23) 21.07,2.23 21.09,2.21 21.58,2.21 21.6,2.23 22.4,2.23 24.03,0.61 31.71,0.61 v2(32.29,1.19) 36.14,1.19 v2(36.32,1.02) ; v2(43.05,3.56) 43.05,4.83 45.72,7.49 48.15,7.49 CN1.2
GPIO6: length 46.8
  Top Layer w0.254: v2(37.59,1.91) 37.08,2.41 32.51,2.41 31.29,1.19 v2(29.21,1.19) ; v2(49.4,3.43) 49.56,3.43 ; 49.56,3.43 58.94,3.43 R14.2 ; 49.56,3.43 U4.24 ; v2(21.34,2.79) 20.79,3.34 20.79,3.36 20.62,3.52 20.23,3.52 20.22,3.53 U1.12
  Bottom Layer w0.254: v2(21.34,2.79) 22.61,2.79 24.21,1.19 v2(29.21,1.19) ; v2(37.59,1.91) 47.88,1.91 v2(49.4,3.43)
GPIO7: length 48.4
  Top Layer w0.254: U4.23 51.18,6.1 v2(50.67,5.59) ; R15.2 60.84,6.61 59.31,5.08 v2(59.18,5.08) ; U1.13 21.47,3.93 v2(21.91,3.49)
  Bottom Layer w0.254: v2(21.91,3.49) 22.8,3.49 24.51,1.78 36.7,1.78 37.72,0.76 48.51,0.76 50.67,2.92 v2(50.67,5.59) 51.31,6.22 54.48,6.22 55.8,4.9 57.73,4.9 57.91,5.08 v2(59.18,5.08)
GPIO12: length 88.6
  Top Layer w0.254: U1.18 20.87,5.93 22.73,4.06 29.34,4.06 30.86,5.59 v2(30.99,5.59)
  Bottom Layer w0.254: v2(97.92,10.16) 97.66,10.41 97.66,12.83 96.01,14.48 35.56,14.48 34.67,13.59 34.67,9.14 31.11,5.59 v2(30.99,5.59)
GPIO13: length 84.7
  Top Layer w0.254: U1.19 20.19,6.32 21.11,6.32 22.99,4.45 28.96,4.45 31.11,6.6 42.29,6.6 48.13,0.76 v2(49.78,0.76)
  Bottom Layer w0.254: 98.3,3.3 98.3,1.27 97.46,0.43 50.12,0.43 v2(49.78,0.76)
  vias: v2(98.3,3.31)
SPICLK: length 76.9
  Top Layer w0.254: U2.6 77.87,6.16 79.5,7.79 79.5,10.16 75.1,14.56 34.24,14.56 33.53,13.84 33.53,12.57 v2(33.4,12.45)
  Bottom Layer w0.254: v2(33.4,12.45) 34.04,11.81 34.04,10.3 32.12,8.38 30.73,8.38 25.6,13.51 18.34,13.51 18.16,13.34 R4.2
SPICS0: length 61.8
  Top Layer w0.254: U1.20 21.34,6.73 22.86,5.21 23.75,5.21 25.53,6.98 27.64,6.98 28.02,7.37 42.67,7.37 42.69,7.35 ; 42.69,7.35 48.51,1.52 62.15,1.52 69.51,8.89 U2.1 70.05,9.05 70.05,10.36 70.99,11.3 72.91,11.3 R10.1 ; 42.69,7.35 42.81,7.35
SPID: length 65
  Top Layer w0.254: U2.5 78.99,5.08 80.14,6.22 80.14,11.94 78.49,13.59 v2(77.85,13.59) ; 29.08,8.51 29.08,9.78 30.86,11.56 33.53,11.56 34.04,12.06 34.04,13.21 34.92,14.1 51.18,14.1 52.47,12.81 74.91,12.81 v2(75.06,12.95)
  Bottom Layer w0.254: v2(77.85,13.59) 75.69,13.59 v2(75.06,12.95)
  vias: v2(28.95,8.76)
SPIHD: length 68.8
  Top Layer w0.254: v2(30.03,8) 30.32,8.29 30.32,10.38 31.14,11.2 33.81,11.2 34.54,11.94 34.54,12.83 35.31,13.59 49.66,13.59 51.94,11.3 67.82,11.3 68.97,12.45 73.4,12.45 73.79,12.06 73.79,10.54 76.71,7.62 U2.7 ; v2(21.21,12.19) 21.21,11.81 v2(22.99,10.03)
  Bottom Layer w0.254: R7.2 19.95,12.19 v2(21.21,12.19) ; v2(30.03,8) 28.45,8 28.19,8.26 28.19,9.4 27.81,9.78 23.24,9.78 v2(22.99,10.03)
SPIQ: length 46
  Top Layer w0.254: v2(64.52,1.85) 64.72,1.85 66.93,4.06 66.93,5.33 69.22,7.62 U2.2
  Bottom Layer w0.254: R8.2 40,4.32 41.91,2.41 46.99,2.41 48.64,4.06 49.53,4.06 50.04,4.57 50.04,7.49 50.29,7.75 54.99,7.75 57.07,5.66 60.12,5.66 63.93,1.85 v2(64.52,1.85)
SPIWP: length 56.3
  Top Layer w0.254: v2(67.82,3.68) 67.82,4.66 69.51,6.35 U2.3 ; v2(46.86,5.33) 46.86,6.1 47.37,6.6 49.02,6.6 50.04,7.62 50.04,8.76 52.07,10.8 64.52,10.8 66.55,8.76 66.55,8 65.28,6.73 v2(65.28,6.22)
  Bottom Layer w0.254: v2(46.86,5.33) 46.86,4.7 44.96,2.79 42.67,2.79 40.13,5.33 31.88,5.33 29.97,3.43 R9.2 ; v2(67.82,3.68) v2(65.28,6.22)
U0RXD: length 94.9
  Top Layer w0.254: v2(63.98,4.98) 63.91,4.98 61.09,2.16 48.39,2.16 43.81,6.73 43.81,7.49 43.56,7.75 33.15,7.75 v2(31.5,9.4) ; v2(26.03,10.41) 28.19,10.41 28.88,11.1 29.02,11.1 29.18,11.26 29.18,11.4 v2(30.1,12.32) ; v2(14.61,8.26) 14.61,7.87 15.14,7.34 U1.30 ; v2(91.31,2.29) 95,2.29 H1.1
  Bottom Layer w0.254: v2(14.61,8.26) 14.61,10.54 15.49,11.43 24.77,11.43 25.78,10.41 v2(26.03,10.41) ; v2(30.1,12.32) 30.61,12.32 31.62,11.3 31.62,9.53 v2(31.5,9.4) ; v2(63.98,4.98) 65.37,4.98 68.33,2.03 91.06,2.03 v2(91.31,2.29)
U0TXD: length 89.9
  Top Layer w0.254: v2(32.8,10.06) 32.84,10.02 36.69,10.02 36.85,10.18 37.9,10.18 37.92,10.19 38.16,10.19 38.23,10.12 39.37,10.12 39.44,10.19 39.68,10.19 39.76,10.11 40.89,10.11 40.96,10.18 41.1,10.18 41.27,10.02 43.96,10.02 45.09,8.89 45.09,6.2 48.49,2.79 v2(59.82,2.79)
  Bottom Layer w0.254: v2(32.8,10.06) 32.8,9.83 31.73,8.76 31.11,8.76 25.91,13.97 17.14,13.97 16.38,13.21 R3.1 ; v2(59.82,2.79) 60.83,2.79 62.48,1.14 91.57,1.14 H1.2
USB_D+: length 8.3
  Top Layer w0.254: USB1.6 103.42,6.98 104.01,6.98 104.25,7.22 104.25,7.75 104.08,7.92 103.49,7.92 USB1.8 101.87,7.99 101.16,8.7 C16.2 100.02,8.64 R11.2
USB_D-: length 7.6
  Top Layer w0.254: 102.59,7.02 102.59,6.72 102.75,6.56 103.34,6.56 USB1.5 ; 102.59,7.02 102.58,7.02 C15.2 100.38,4.82 R12.2 ; 102.59,7.02 102.59,7.25 102.75,7.42 103.34,7.42 USB1.7
XTAL_N: length 22
  Top Layer w0.254: U1.38 14.3,3.93 13.21,5.02 13.21,10.16 15.37,12.32 19.05,12.32 23.61,7.76 R2.1
XTAL_P: length 27.3
  Top Layer w0.254: 26.92,7.76 26.16,8.51 23.62,8.51 18.92,13.21 14.35,13.21 12.47,11.33 12.47,4.93 13.87,3.54 15.35,3.54 U1.39
$1N461: length 14.9
  Top Layer w0.254: U1.1 15.71,2.27 13.35,2.27 6.73,8.89 RF1.1
$1N695: length 1.5
  Top Layer w0.254: C8.2 40.38,10.73 L1.2
$1N1096: length 3.5
  Top Layer w0.254: v2(18.15,9.4) 17.98,9.22 17.98,7.34 U1.25
  Bottom Layer w0.254: 18.16,10.8 18.16,9.41 v2(18.15,9.4)
$1N1204: length 16.9
  Top Layer w0.254: U1.21 20.29,7.34 v2(20.45,7.49)
  Bottom Layer w0.254: R8.1 32.7,3.49 31.5,2.29 25.27,2.29 20.45,7.11 v2(20.45,7.49)
$1N1242: length 10.4
  Top Layer w0.254: v2(22.99,6.1) 20.95,8.13 19.52,8.13 19.18,7.78 19.18,7.34 U1.22
  Bottom Layer w0.254: v2(22.99,6.1) 22.99,5.33 24.89,3.43 R9.1
$1N1499: length 4.4
  Top Layer w0.254: v2(19.43,9.53) 19.3,9.53 18.37,8.59 U1.24
  Bottom Layer w0.254: R7.1 20.06,10.8 20.07,10.8 20.07,10.16 v2(19.43,9.53)
$1N1548: length 12.6
  Top Layer w0.254: v2(21.08,9.27) 20.19,10.16 17.91,10.16 17.57,9.82 U1.26
  Bottom Layer w0.254: 27.06,8.89 26.68,9.27 v2(21.08,9.27)
$1N1698: length 3.3
  Top Layer w0.254: v2(16.38,10.65) 16.37,10.63 U1.29
$1N2295: length 9
  Top Layer w0.254: 27.18,9.01 27.44,9.27 27.88,9.27 30.99,12.38 30.99,13.21 30.52,13.68 28.19,13.68
$1N2413: length 7.1
  Top Layer w0.254: X1.1 24.64,10.61 24.64,10.03 ; 24.64,10.03 R2.2 ; 24.64,10.03 23.81,10.03 22.86,10.99 C5.2
$1N3029: length 10.4
  Top Layer w0.254: SW1.5 SW1.2
  Bottom Layer w0.254: SW1.2 87.79,7.37 85.09,7.37
$2N245: length 5.9
  Bottom Layer w0.254: C19.1 43.12,9.15 R17.1 44.26,10.47 SW2.2
$2N875: length 13.6
  Top Layer w0.254: U4.20 51.65,7.52 51.46,7.52 50.8,8.17 50.8,8.89 52.32,10.41 56.9,10.41 58.55,8.76 C18.1
$2N1093: length 2.4
  Top Layer w0.254: U4.10 57.32,7.1 C22.1

## Copper pours and planes (outline as drawn; the poured copper is in the pictures)
GND on Top Layer: 11.99,14.99 111.45,14.99 111.45,0 11.99,0
GND on Bottom Layer: 0,14.99 111.63,14.99 111.63,0 0,0
